# EAGLE schematic FedorBall_leds (EAGLE 6.2)
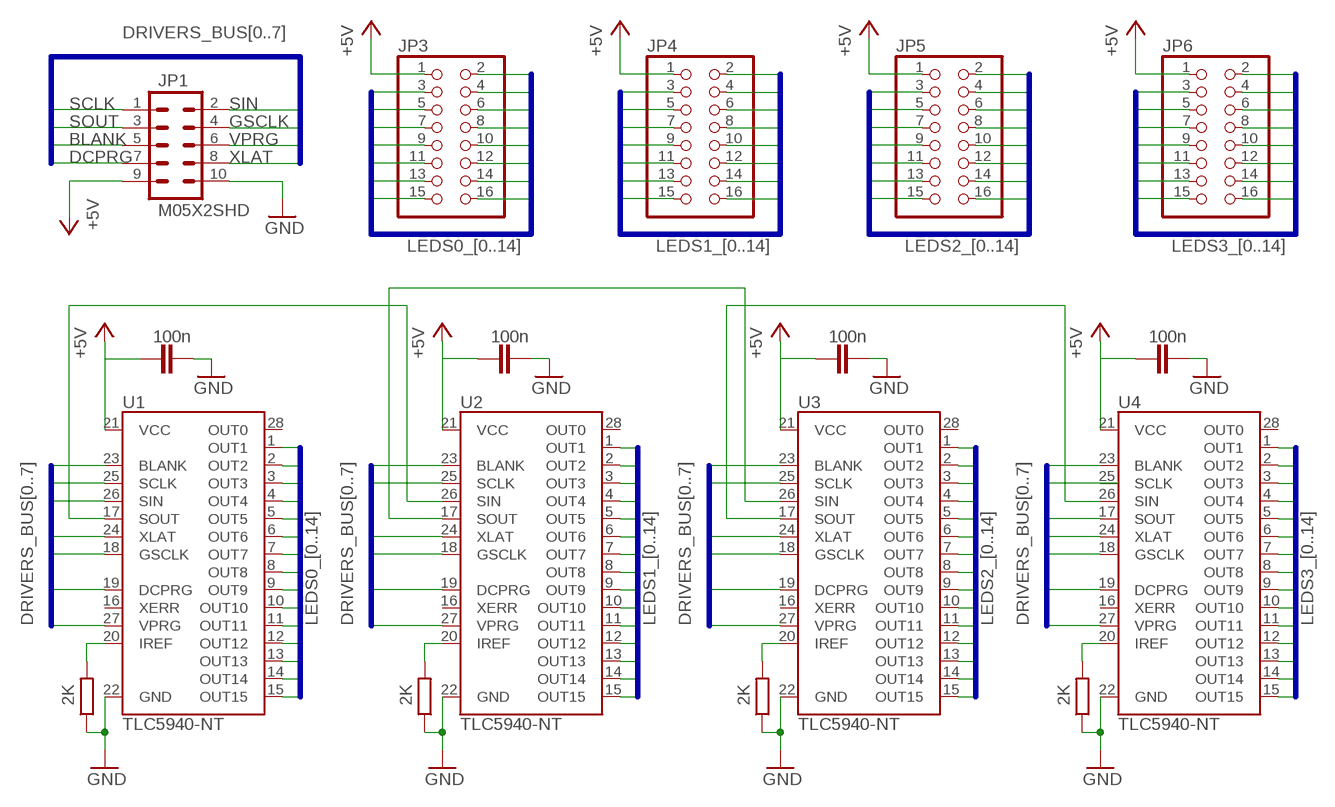
[diagram p0: schematic, sheet 1]

## Parts
C1  100n  C-EU025-024X044  [C025-024X044]
C2  100n  C-EU025-024X044  [C025-024X044]
C3  100n  C-EU025-024X044  [C025-024X044]
C4  100n  C-EU025-024X044  [C025-024X044]
JP1  M05X2SHD  [2X5-SHROUDED]
JP3  PINHD-2X8  [2X08]
JP4  PINHD-2X8  [2X08]
JP5  PINHD-2X8  [2X08]
JP6  PINHD-2X8  [2X08]
R1  2K  R-EU_0204/5  [0204/5]
R2  2K  R-EU_0204/5  [0204/5]
R3  2K  R-EU_0204/5  [0204/5]
R4  2K  R-EU_0204/5  [0204/5]
U1  TLC5940-NT  [DIL28-3]
U2  TLC5940-NT  [DIL28-3]
U3  TLC5940-NT  [DIL28-3]
U4  TLC5940-NT  [DIL28-3]

## Nets
+5V: C1.1 C2.1 C3.1 C4.1 JP1.9 JP3.1 JP4.1 JP5.1 JP6.1 U1.21(VCC) U2.21(VCC) U3.21(VCC) U4.21(VCC)
DRIVERS_BUS0: JP1.5 U1.23(BLANK) U2.23(BLANK) U3.23(BLANK) U4.23(BLANK)
DRIVERS_BUS1: JP1.1 U1.25(SCLK) U2.25(SCLK) U3.25(SCLK)
DRIVERS_BUS2: JP1.2 U1.26(SIN)
DRIVERS_BUS3: JP1.3 U4.17(SOUT)
DRIVERS_BUS4: JP1.8 U1.24(XLAT) U2.24(XLAT) U3.24(XLAT) U4.24(XLAT)
DRIVERS_BUS5: JP1.4 U1.18(GSCLK) U2.18(GSCLK) U3.18(GSCLK) U4.18(GSCLK)
DRIVERS_BUS6: JP1.7 U1.19(DCPRG) U2.19(DCPRG) U3.19(DCPRG) U4.19(DCPRG)
DRIVERS_BUS7: JP1.6 U1.27(VPRG) U2.27(VPRG) U3.27(VPRG) U4.27(VPRG)
GND: C1.2 C2.2 C3.2 C4.2 JP1.10 R1.1 R2.1 R3.1 R4.1 U1.22(GND) U2.22(GND) U3.22(GND) U4.22(GND)
LEDS0_0: JP3.16 U1.1(OUT1)
LEDS0_1: JP3.15 U1.2(OUT2)
LEDS0_2: JP3.14 U1.3(OUT3)
LEDS0_3: JP3.13 U1.4(OUT4)
LEDS0_4: JP3.12 U1.5(OUT5)
LEDS0_5: JP3.11 U1.6(OUT6)
LEDS0_6: JP3.10 U1.7(OUT7)
LEDS0_7: JP3.9 U1.8(OUT8)
LEDS0_8: JP3.8 U1.9(OUT9)
LEDS0_9: JP3.7 U1.10(OUT10)
LEDS0_10: JP3.6 U1.11(OUT11)
LEDS0_11: JP3.5 U1.12(OUT12)
LEDS0_12: JP3.4 U1.13(OUT13)
LEDS0_13: JP3.3 U1.14(OUT14)
LEDS0_14: JP3.2 U1.15(OUT15)
LEDS1_0: JP4.16 U2.1(OUT1)
LEDS1_1: JP4.15 U2.2(OUT2)
LEDS1_2: JP4.14 U2.3(OUT3)
LEDS1_3: JP4.13 U2.4(OUT4)
LEDS1_4: JP4.12 U2.5(OUT5)
LEDS1_5: JP4.11 U2.6(OUT6)
LEDS1_6: JP4.10 U2.7(OUT7)
LEDS1_7: JP4.9 U2.8(OUT8)
LEDS1_8: JP4.8 U2.9(OUT9)
LEDS1_9: JP4.7 U2.10(OUT10)
LEDS1_10: JP4.6 U2.11(OUT11)
LEDS1_11: JP4.5 U2.12(OUT12)
LEDS1_12: JP4.4 U2.13(OUT13)
LEDS1_13: JP4.3 U2.14(OUT14)
LEDS1_14: JP4.2 U2.15(OUT15)
LEDS2_0: JP5.16 U3.1(OUT1)
LEDS2_1: JP5.15 U3.2(OUT2)
LEDS2_2: JP5.14 U3.3(OUT3)
LEDS2_3: JP5.13 U3.4(OUT4)
LEDS2_4: JP5.12 U3.5(OUT5)
LEDS2_5: JP5.11 U3.6(OUT6)
LEDS2_6: JP5.10 U3.7(OUT7)
LEDS2_7: JP5.9 U3.8(OUT8)
LEDS2_8: JP5.8 U3.9(OUT9)
LEDS2_9: JP5.7 U3.10(OUT10)
LEDS2_10: JP5.6 U3.11(OUT11)
LEDS2_11: JP5.5 U3.12(OUT12)
LEDS2_12: JP5.4 U3.13(OUT13)
LEDS2_13: JP5.3 U3.14(OUT14)
LEDS2_14: JP5.2 U3.15(OUT15)
LEDS3_0: JP6.16 U4.1(OUT1)
LEDS3_1: JP6.15 U4.2(OUT2)
LEDS3_2: JP6.14 U4.3(OUT3)
LEDS3_3: U4.4(OUT4)
LEDS3_4: JP6.12 U4.5(OUT5)
LEDS3_5: JP6.11 U4.6(OUT6)
LEDS3_6: JP6.10 U4.7(OUT7)
LEDS3_7: JP6.9 U4.8(OUT8)
LEDS3_8: JP6.8 U4.9(OUT9)
LEDS3_9: JP6.7 U4.10(OUT10)
LEDS3_10: JP6.6 U4.11(OUT11)
LEDS3_11: JP6.5 U4.12(OUT12)
LEDS3_12: JP6.4 U4.13(OUT13)
LEDS3_13: JP6.3 U4.14(OUT14)
LEDS3_14: JP6.2 U4.15(OUT15)
N$1: U1.17(SOUT) U2.26(SIN)
N$2: U2.17(SOUT) U3.26(SIN)
N$3: U3.17(SOUT) U4.26(SIN)
N$4: R2.2 U1.20(IREF)
N$5: R4.2 U2.20(IREF)
N$6: R3.2 U3.20(IREF)
N$7: R1.2 U4.20(IREF)
Unconnected: JP6.13 U1.16(XERR) U1.28(OUT0) U2.16(XERR) U2.28(OUT0) U3.16(XERR) U3.28(OUT0) U4.16(XERR) U4.25(SCLK) U4.28(OUT0)

## Buses
DRIVERS_BUS[0..7]
LEDS0_[0..14]
LEDS1_[0..14]
LEDS2_[0..14]
LEDS3_[0..14]

## Notes on the sheet
- SCLK | SIN
- SOUT | GSCLK
- BLANK | VPRG
- DCPRG | XLAT

## Library data of the parts
C1-C4 = rcl:C-EU: CAPACITOR, European symbol
JP1 = SparkFun:M05X2: Header 5x2 Standard 10-pin dual row 0.1" header. Commonly used with AVR-ISP. Use with Spark Fun Electronics SKU: PRT-00778
JP3-JP6 = pinhead:PINHD-2X8: PIN HEADER
R1-R4 = resistor:R-EU_: RESISTOR, European symbol
U1-U4 = SparkFun:TLC5940: TI TLC5940 16-channel LED Driver with Dot Correction and Grayscale PWM Control The TLC5940 is a 16-channel, constant-current sink LED driver. Each channel has an individually adjustable 4096-step grayscale PWM brightness control and a 64-step, constant-current sink (dot correction). The dot correction adjusts the brightness variations between LED channels and other LED drivers. The dot correction data is stored in an integrated EEPROM. Both grayscale control and dot correction are accessible via a serial interface. A single external resistor sets the maximum current value of all 16 channels. Packages: 28-pin HTSSOP 32-pin 5x5mm QFN 28-pin DIP